# Altium schematic sheet Power_2.SchDoc
size A4; SheetNumber: 2; SheetTotal: 8
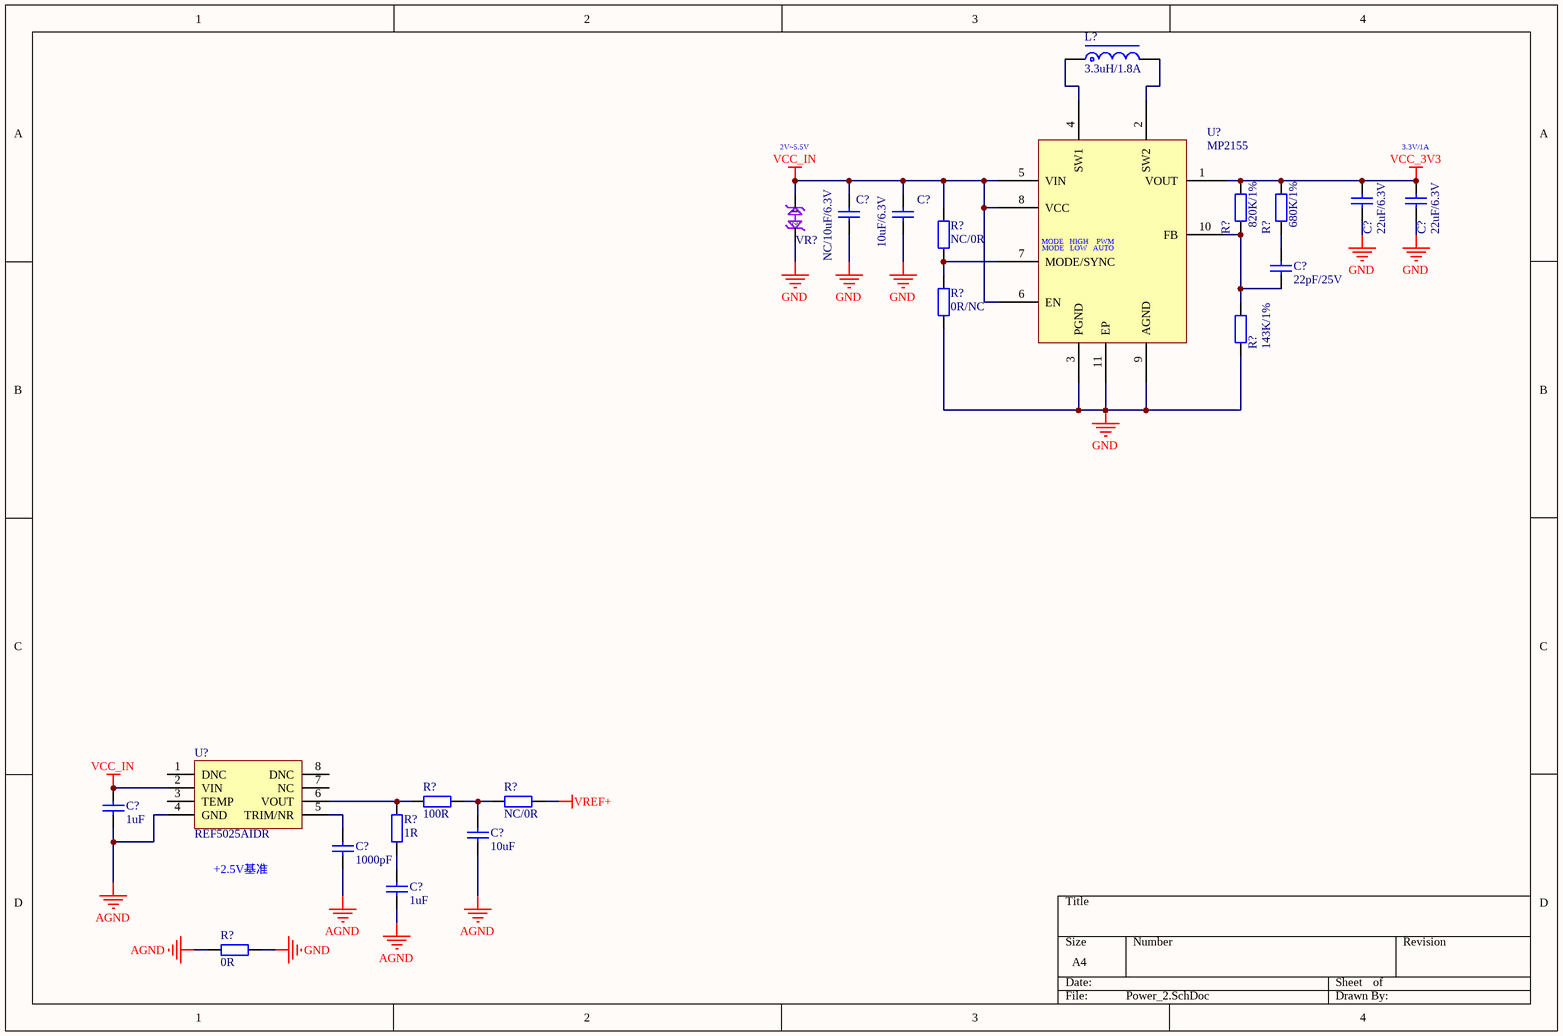
[diagram p0: Power_2.SchDoc]

## Parts
(Parts that share a designator on the sheet are numbered #1, #2 ... from top to bottom, then left to right.)
C?#1  22uF/6.3V  [C0603_L]
C?#2  22uF/6.3V  [C0603_L]
C?#3  NC/10uF/6.3V  [C0603_L]
C?#4  10uF/6.3V  [C0603_L]
C?#5  22pF/25V  [C0402_L]
C?#6  1uF  [C0402_L]
C?#7  10uF  [C0603_L]
C?#8  1000pF  [C0603_L]
C?#9  1uF  [C0402_L]
L?  3.3uH/1.8A  [NR2520]
R?#1  820K/1%  [R0402_L]
R?#2  680K/1%  [R0402_L]
R?#3  NC/0R  [R0402_L]
R?#4  0R/NC  [R0402_L]
R?#5  143K/1%  [R0402_L]
R?#6  100R  [R0402_L]
R?#7  NC/0R  [R0402_L]
R?#8  1R  [R0402_L]
R?#9  0R  [R0402_L]
U?#1  MP2155  [QFN10(3mmX3mm)]
U?#2  REF5025AIDR  [SOIC-8L]
VR?  UAD8C05L01  [SOD882]  (value not drawn)

## Nets
AGND: C?#6.1 C?#7.1 C?#8.1 C?#9.1 R?#9.1 U?#2.4(GND)
GND: C?#1.1 C?#2.1 C?#3.1 C?#4.1 R?#4.1 R?#5.1 R?#9.2 U?#1.3(PGND) U?#1.9(AGND) U?#1.11(EP) VR?.2
VCC_3V3: C?#1.2 C?#2.2 R?#1.2 R?#2.2 U?#1.1(VOUT)
VCC_IN: C?#3.2 C?#4.2 C?#6.2 R?#3.2 U?#1.5(VIN) U?#1.6(EN) U?#1.8(VCC) U?#2.2(VIN) VR?.1
VREF+: R?#7.2
NetC?#5_1: C?#5.1 R?#1.1 R?#5.2 U?#1.10(FB)
NetC?#5_2: C?#5.2 R?#2.1
NetC?#7_2: C?#7.2 R?#6.2 R?#7.1
NetC?#8_2: C?#8.2 U?#2.5(TRIM/NR)
NetC?#9_2: C?#9.2 R?#8.1
NetL?_1: L?.1 U?#1.4(SW1)
NetL?_2: L?.2 U?#1.2(SW2)
NetR?#3_1: R?#3.1 R?#4.2 U?#1.7(MODE/SYNC)
NetR?#6_1: R?#6.1 R?#8.2 U?#2.6(VOUT)

Not connected (* = marked no-connect by the designer): U?#2 1(DNC) 3(TEMP) 7(NC) 8(DNC)

## Notes on the sheet
- 2V~5.5V
- (near C?#2) 3.3V/1A
- (near U?#1) MODE   HIGH    PWM
- (near U?#1) MODE   LOW   AUTO
- +2.5V基准

## Library data of the parts
C?#1-C?#9 = C: 贴片电容; BOM名称: 无极性贴片电容; 联系卖家，免费查找封装: 唯一出售店铺网址https://shop463601444.taobao.com
L? = L-NR: 太诱-NR磁胶电感; BOM名称: NR磁胶电感; 联系卖家，免费查找封装: 唯一出售店铺网址https://shop463601444.taobao.com
R?#1-R?#9 = R: 贴片电阻; 联系卖家，免费查找封装: 唯一出售店铺网址https://shop463601444.taobao.com; BOM名称: 贴片电阻
U?#1 = MP2155: 高效、低静态电流的Buck-Boost变换器
U?#2 = REF5025AIDR: 3uVpp/V噪声 3ppm/℃漂移 电压基准 0.05%